# Altium schematic sheet Shut_Down.SchDoc
size A2
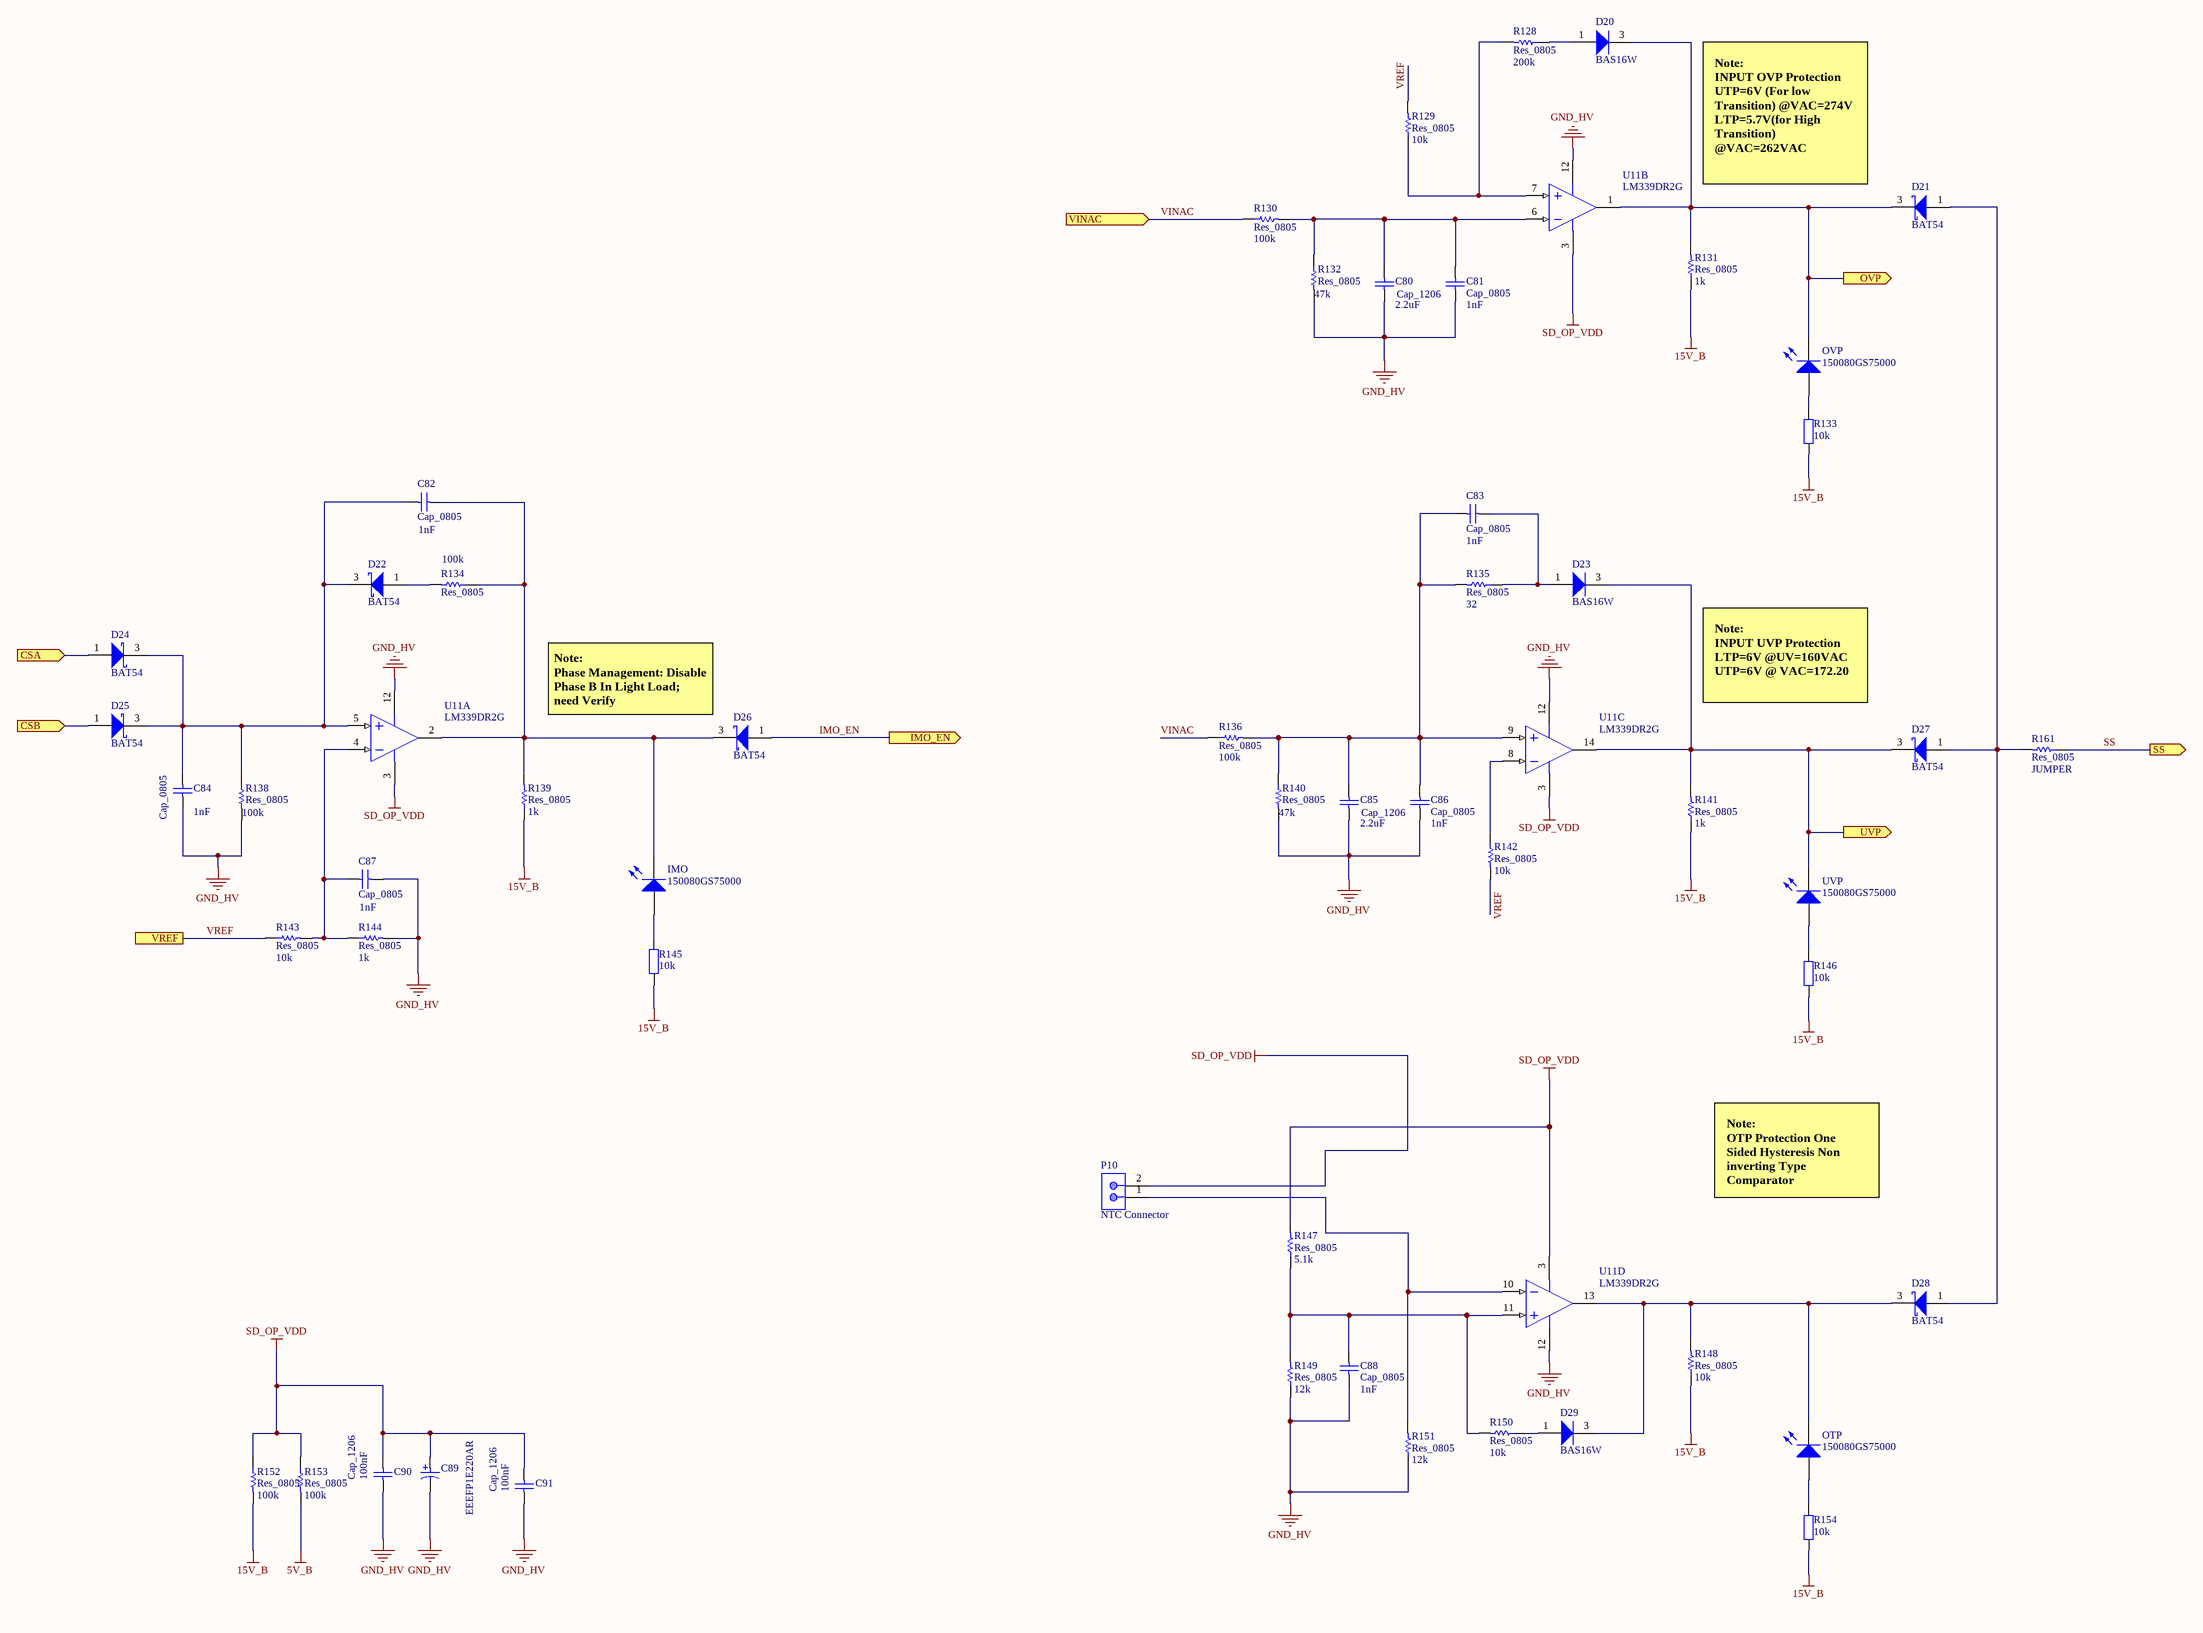
[diagram p0: Shut_Down.SchDoc]

## Parts
C80  Cap_1206  value 2.2uF  [SMD-1206C]
C81  Cap_0805  Size: 1nF  [SMD-0805C]
C82  Cap_0805  Size: 1nF  [SMD-0805C]
C83  Cap_0805  Size: 1nF  [SMD-0805C]
C84  Cap_0805  Size: 1nF  [SMD-0805C]
C85  Cap_1206  value 2.2uF  [SMD-1206C]
C86  Cap_0805  Size: 1nF  [SMD-0805C]
C87  Cap_0805  Size: 1nF  [SMD-0805C]
C88  Cap_0805  Size: 1nF  [SMD-0805C]
C89  EEEFP1E220AR  [PNSC-FP-V-C_V]
C90  Cap_1206  value 100nF  [SMD-1206C]
C91  Cap_1206  value 100nF  [SMD-1206C]
D20  BAS16W  [SOT95P278X110-3N]
D21  BAT54  [SOT95P278X110-3N]
D22  BAT54  [SOT95P278X110-3N]
D23  BAS16W  [SOT95P278X110-3N]
D24  BAT54  [SOT95P278X110-3N]
D25  BAT54  [SOT95P278X110-3N]
D26  BAT54  [SOT95P278X110-3N]
D27  BAT54  [SOT95P278X110-3N]
D28  BAT54  [SOT95P278X110-3N]
D29  BAS16W  [SOT95P278X110-3N]
IMO  150080GS75000  [0805_A]
OTP  150080GS75000  [0805_A]
OVP  150080GS75000  [0805_A]
P10  NTC Connector  [61900211121]
R128  Res_0805  value 200k  [WRIS-KSKE_0805_H=0.6mm]
R129  Res_0805  value 10k  [WRIS-KSKE_0805_H=0.6mm]
R130  Res_0805  value 100k  [WRIS-KSKE_0805_H=0.6mm]
R131  Res_0805  value 1k  [WRIS-KSKE_0805_H=0.6mm]
R132  Res_0805  value 47k  [WRIS-KSKE_0805_H=0.6mm]
R133  10k  [WRIS-KSKE_0805_H=0.6mm]
R134  Res_0805  value 100k  [WRIS-KSKE_0805_H=0.6mm]
R135  Res_0805  value 32  [WRIS-KSKE_0805_H=0.6mm]
R136  Res_0805  value 100k  [WRIS-KSKE_0805_H=0.6mm]
R138  Res_0805  value 100k  [WRIS-KSKE_0805_H=0.6mm]
R139  Res_0805  value 1k  [WRIS-KSKE_0805_H=0.6mm]
R140  Res_0805  value 47k  [WRIS-KSKE_0805_H=0.6mm]
R141  Res_0805  value 1k  [WRIS-KSKE_0805_H=0.6mm]
R142  Res_0805  value 10k  [WRIS-KSKE_0805_H=0.6mm]
R143  Res_0805  value 10k  [WRIS-KSKE_0805_H=0.6mm]
R144  Res_0805  value 1k  [WRIS-KSKE_0805_H=0.6mm]
R145  10k  [WRIS-KSKE_0805_H=0.6mm]
R146  10k  [WRIS-KSKE_0805_H=0.6mm]
R147  Res_0805  value 5.1k  [WRIS-KSKE_0805_H=0.6mm]
R148  Res_0805  value 10k  [WRIS-KSKE_0805_H=0.6mm]
R149  Res_0805  value 12k  [WRIS-KSKE_0805_H=0.6mm]
R150  Res_0805  value 10k  [WRIS-KSKE_0805_H=0.6mm]
R151  Res_0805  value 12k  [WRIS-KSKE_0805_H=0.6mm]
R152  Res_0805  value 100k  [WRIS-KSKE_0805_H=0.6mm]
R153  Res_0805  value 100k  [WRIS-KSKE_0805_H=0.6mm]
R154  10k  [WRIS-KSKE_0805_H=0.6mm]
R161  Res_0805  value JUMPER  [WRIS-KSKE_0805_H=0.6mm]
U11  LM339DR2G  [SOIC127P600X265-14N]  (parts A,B,C,D of 4)
UVP  150080GS75000  [0805_A]

## Ports
CSA (in), CSB (in), IMO_EN (out), OVP (out), SS (out), UVP (out), VINAC (in), VREF

## Nets
5V_B: R153.2
15V_B: R131.1 R133.1 R139.1 R141.1 R145.1 R146.1 R148.1 R152.2 R154.1
GND_HV: C80.2 C81.1 C84.1 C85.2 C86.1 C87.2 C88.1 C89.2 C90.2 C91.2 R132.2 R138.2 R140.2 R144.2 R149.1 R151.1 U11.12(GND)
SD_OP_VDD: C89.1 C90.1 C91.1 P10.2 R147.2 R152.1 R153.1 U11.3(VCC)
CSA: D24.1(A) ; port CSA
CSB: D25.1(A) ; port CSB
IMO_EN: D26.1(A) ; port IMO_EN
OVP: D20.3(K) D21.3(K) OVP.1(K) R131.2 U11.1(OUT2) ; port OVP
SS: R161.1 ; port SS
UVP: D23.3(K) D27.3(K) R141.2 U11.14(OUT3) UVP.1(K) ; port UVP
VINAC: R130.1 R136.1 ; port VINAC
VREF: R129.2 R142.2 R143.1 ; port VREF
NetC80_1: C80.1 C81.2 R130.2 R132.1 U11.6(IN2-)
NetC82_1: C82.1 C84.2 D22.3(K) D24.3(K) D25.3(K) R138.1 U11.5(IN1+)
NetC82_2: C82.2 D26.3(K) IMO.1(K) R134.1 R139.2 U11.2(OUT1)
NetC83_1: C83.1 D23.1(A) R135.1
NetC83_2: C83.2 C85.1 C86.2 R135.2 R136.2 R140.1 U11.9(IN3+)
NetC87_1: C87.1 R143.2 R144.1 U11.4(IN1-)
NetC88_2: C88.2 R147.1 R149.2 R150.2 U11.11(IN4+)
NetD20_1: D20.1(A) R128.1
NetD21_1: D21.1(A) D27.1(A) D28.1(A) R161.2
NetD22_1: D22.1(A) R134.2
NetD28_3: D28.3(K) D29.3(K) OTP.1(K) R148.2 U11.13(OUT4)
NetD29_1: D29.1(A) R150.1
NetIMO_2: IMO.2(A) R145.2
NetOTP_2: OTP.2(A) R154.2
NetOVP_2: OVP.2(A) R133.2
NetP10_1: P10.1 R151.2 U11.10(IN4-)
NetR128_2: R128.2 R129.1 U11.7(IN2+)
NetR142_1: R142.1 U11.8(IN3-)
NetR146_2: R146.2 UVP.2(A)

## Notes on the sheet
- Note:                                                                                   INPUT OVP Protection                         UTP=6V (For low Transition) @VAC=274V              LTP=5.7V(for High Transition) @VAC=262VAC
- Note:
  INPUT UVP Protection                                               LTP=6V @UV=160VAC UTP=6V @ VAC=172.20
- (near D26) Note:
  Phase Management: Disable Phase B In Light Load; need Verify
- Note:
  OTP Protection One Sided Hysteresis Non inverting Type Comparator

## Library data of the parts
C80 C85 C90 C91 = Cap: Capacitor; Published: 8-Jun-2000; LatestRevisionDate: 17-Jul-2002; LatestRevisionNote: Re-released for DXP Platform.; PackageReference: RAD-0.3; Publisher: Altium Limited; PackageDescription: Radial Cap, Thru-Hole; 2 Leads; 0.3 in Pin Spacing
C81-C84 C86-C88 = Cap: Capacitor; Value: 100pF; Published: 8-Jun-2000; LatestRevisionDate: 17-Jul-2002; LatestRevisionNote: Re-released for DXP Platform.; PackageReference: RAD-0.3; Publisher: Altium Limited; PackageDescription: Radial Cap, Thru-Hole; 2 Leads; 0.3 in Pin Spacing
C89 = CMP-2000-06213-1: Aluminum Electrolytic Capacitor, 22 uF, +/- 20%, 25 V, 2-Pin SMD (Size Code C), -55 to 105 degC, RoHS, Tape and Reel; Manufacturer: Panasonic; ESR (Equivalent Series Resistance): 0.36O; Ripple Current: 240mA; Capacitance: 22µF; Lifetime@Temperature: 2000Hrs@105°C; Rated Voltage: 25V; Type: Can; Package Reference: FP-V-C; Package Description: 2-Pin Electrolytic Aluminum Capacitor, Body 5.3 x 5.3 mm; Operating Temp Range: -55to+105°C; Mounting Technology: SurfaceMount; Datasheet URL: http://industrial.panasonic.com/cdbs/www-data/pdf/RDE0000/ABA0000C1184.pdf; Case Size/Dimension: Ø5x5.8mm; Operating Temp-Max: 105°C; Package URL: http://industrial.panasonic.com/cdbs/www-data/pdf/RDE0000/DME0000COL48.pdf; Datasheet Version: 03/2016; Series: FP; Manufacturer URL: http://www.panasonic.com/
D20 D23 D29 = BAS16: Silicon Switching Diode, SOT323, Reel, Green; Manufacturer: Infineon; IR (max): 100Â nA; Configuration: Single; VBR (min): 85Â V; VR (max): 80Â V; trr (max): 4Â ns; Green: TRUE; VF (max): 1.25Â V; IF (max): 250Â mA; Mounting Technology: Surface Mount; PackageReference: SOT323; ComponentLink2URL: http://www.infineon.com/dgdl/bas16series.pdf?folderId=db3a30431400ef6801141b5844e103ea&fileId=db3a30431400ef6801141b93811b03ff; Halogen-free: TRUE; ComponentLink2Description: Datasheet; PartNumber: BAS16W; ComponentLink1Description: Manufacturer URL; ComponentLink3URL: http://www.infineon.com/dgdl/SOT323-Package_Overview.pdf?folderId=db3a30431936bc4b0119533e1dcb3c92&fileId=db3a30431936bc4b011953495f283cb1; ComponentLink1URL: http://www.infineon.com/; PackageDescription: 3-Pin Small Outline Transistor Package, 1.25 x 2 mm Body, 0.65 mm Pitch; ComponentLink3Description: Package Specification
D21 D22 D24-D28 = BAT54: Silicon Switching Diode, SOT323, Reel, Green; PartNumber: BAS16W; Manufacturer: Infineon; IR (max): 100Â nA; Configuration: Single; VBR (min): 85Â V; VR (max): 80Â V; trr (max): 4Â ns; Green: TRUE; VF (max): 1.25Â V; IF (max): 250Â mA; Mounting Technology: Surface Mount; PackageReference: SOT323; ComponentLink2URL: http://www.infineon.com/dgdl/bas16series.pdf?folderId=db3a30431400ef6801141b5844e103ea&fileId=db3a30431400ef6801141b93811b03ff; Halogen-free: TRUE; ComponentLink2Description: Datasheet; ComponentLink1Description: Manufacturer URL; ComponentLink3URL: http://www.infineon.com/dgdl/SOT323-Package_Overview.pdf?folderId=db3a30431936bc4b0119533e1dcb3c92&fileId=db3a30431936bc4b011953495f283cb1; ComponentLink1URL: http://www.infineon.com/; PackageDescription: 3-Pin Small Outline Transistor Package, 1.25 x 2 mm Body, 0.65 mm Pitch; ComponentLink3Description: Package Specification
IMO OTP OVP UVP = 150080GS75000: SMD mono-color Chip LED, WL-SMCW, Green; PackageReference: 0805_A; Color: Green; PartNumber: 150080GS75000; ComponentLink1Description: Manufacturer URL; ComponentLink1URL: http://www.we-online.com; ComponentLink2Description: Datasheet; ComponentLink2URL: http://katalog.we-online.com/led/datasheet/150080GS75000.pdf
P10 = 61900211121: WR-WTB THT Male Vertical Locking Header, pitch 2.54mm, 2p; Pin Number: 2; Contact Resistance: 20mOhm; Rated Current: 3A; Withstanding Voltage: 1000VAC; Working Voltage: 250VAC; ComponentLink1Description: Manufacturer; ComponentLink1URL: http://www.we-online.de; ComponentLink2Description: Datasheet; ComponentLink2URL: https://www.we-online.com/catalog/datasheet/61900211121.pdf; Pitch: 2.54mm; Published Date: January 2020; Publisher: Wurth Elektronik; Mounting Technology: THT; Packaging: Bag; Operating Temperature: -40 to +105degC; Part Number: 61900211121; Gender: Male; Type: Vertical
R128-R132 R134-R136 R138-R144 R147-R153 R161 = Res1: Resistor; Published: 8-Jun-2000; LatestRevisionDate: 17-Jul-2002; LatestRevisionNote: Re-released for DXP Platform.; PackageReference: AXIAL-0.3; Publisher: Altium Limited; PackageDescription: Axial Device, Thru-Hole; 2 Leads; 0.3 in Pin Spacing
R133 R145 R146 R154 = 560050320001: WRIS-KSKE Thick Film Resistors, size 0805, 0.1Ohm, +/-1%, 0.33W; Rated Current: 1.81A; Temperature Coefficient of Resistance: 250ppm/degC; Technical Reference: KE0805R100F103LAATP0000; ComponentLink1Description: Manufacturer; ComponentLink1URL: http://www.we-online.de; ComponentLink2Description: Datasheet; ComponentLink2URL: https://katalog.we-online.com/pbs/datasheet/560050320001.pdf; Publisher: Wurth Elektronik; Rated Power: 0.33W; Resistance: 0.1Ohm; Mounting Technology: SMT; Height: 0.6mm; Part Number: 560050320001; Packaging: Tape and Reel; Published Date: September 2019; Size: 0805; Length: 2mm; Operating Temperature: -55 to +155degC; Resistance Tolerance: +/-1%; Width: 1.25mm
U11 = LM339: Single Supply Quad Comparators, 0 to 70 degC, 14-Pin SOIC, Pb-Free, Tape and Reel; Manufacturer: On Semiconductor; IO Typ (mA): 16; ComponentLink3URL: http://www.onsemi.com/pub_link/Collateral/751A-03.PDF; RoHS: TRUE; Packing: Tape and Reel; ComponentLink2Description: Datasheet; ComponentLink2URL: http://www.onsemi.com/pub_link/Collateral/LM339-D.PDF; ComponentLink1Description: Manufacturer URL; PackageVersion: Rev. K, 05/2011; DatasheetVersion: Rev. 20; PackageReference: SOIC-14-751A-03; ComponentLink1URL: http://www.onsemi.com/; PartNumber: LM339DR2G; PackageDescription: 14-Pin Small Outline Integrated Circuit, Body 8.65 x 3.9 mm, Pitch 1.27 mm; ComponentLink3Description: Package Specification; Mounting Technology: Surface Mount